# EAGLE schematic Nusbio - Ex Bread Board (EAGLE 7.6.0)
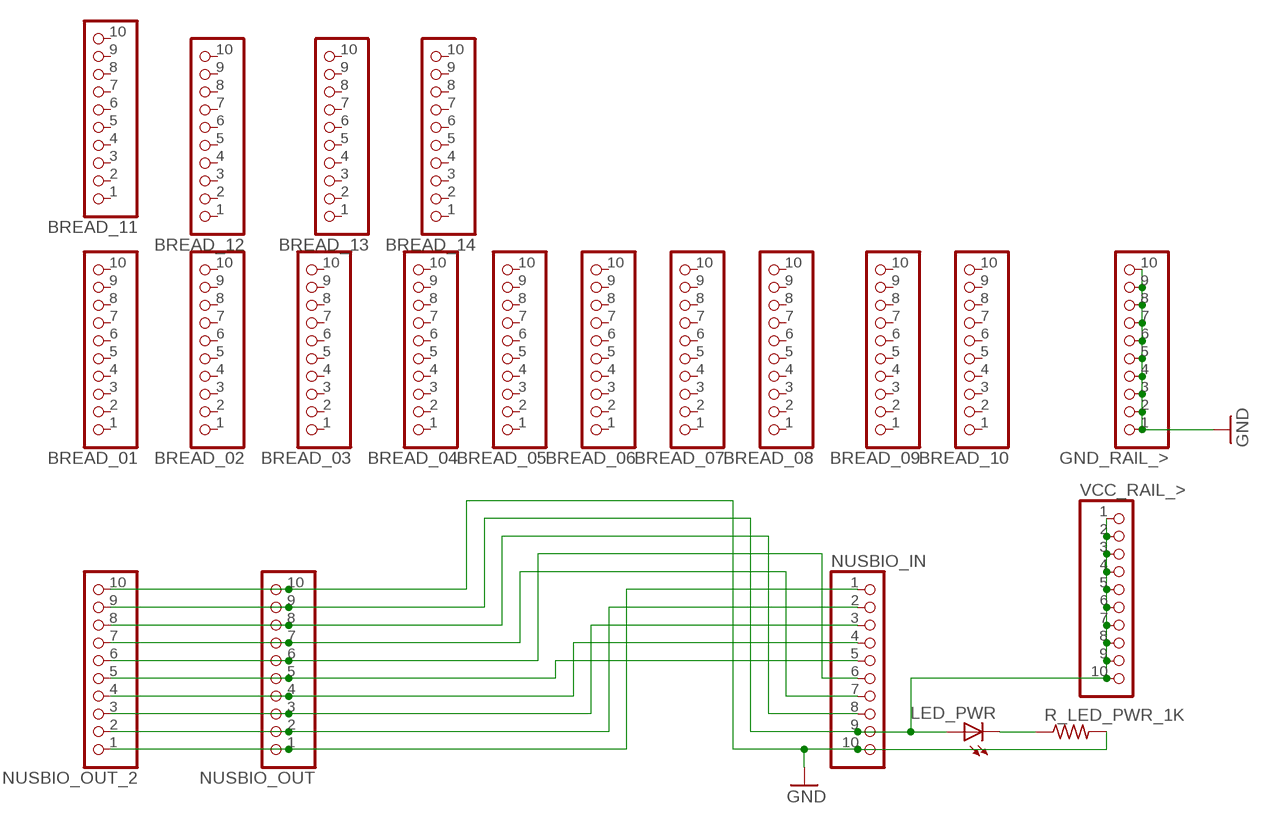
[diagram p0: schematic, sheet 1]

## Parts
BREAD_01  PINHD-1X10  [1X10-BIG]
BREAD_02  PINHD-1X10  [1X10-BIG]
BREAD_03  PINHD-1X10  [1X10-BIG]
BREAD_04  PINHD-1X10  [1X10-BIG]
BREAD_05  PINHD-1X10  [1X10-BIG]
BREAD_06  PINHD-1X10  [1X10-BIG]
BREAD_07  PINHD-1X10  [1X10-BIG]
BREAD_08  PINHD-1X10  [1X10-BIG]
BREAD_09  PINHD-1X10  [1X10-BIG]
BREAD_10  PINHD-1X10  [1X10-BIG]
BREAD_11  PINHD-1X10  [1X10-BIG]
BREAD_12  PINHD-1X10  [1X10-BIG]
BREAD_13  PINHD-1X10  [1X10-BIG]
BREAD_14  PINHD-1X10  [1X10-BIG]
GND_RAIL_>  PINHD-1X10  [1X10-BIG]
LED_PWR  LEDSMT1206  [1206]
NUSBIO_IN  PINHD-1X10  [1X10-BIG]
NUSBIO_OUT  PINHD-1X10  [1X10-BIG]
NUSBIO_OUT_2  PINHD-1X10  [1X10-BIG]
R_LED_PWR_1K  R-US_R1206  [R1206]
VCC_RAIL_>  PINHD-1X10  [1X10-BIG]

## Nets
GND: GND_RAIL_>.1 GND_RAIL_>.2 GND_RAIL_>.3 GND_RAIL_>.4 GND_RAIL_>.5 GND_RAIL_>.6 GND_RAIL_>.7 GND_RAIL_>.8 GND_RAIL_>.9 GND_RAIL_>.10 NUSBIO_IN.10 NUSBIO_OUT.10 NUSBIO_OUT_2.10 R_LED_PWR_1K.2
N$1: NUSBIO_IN.1 NUSBIO_OUT.1 NUSBIO_OUT_2.1
N$2: NUSBIO_IN.2 NUSBIO_OUT.2 NUSBIO_OUT_2.2
N$3: NUSBIO_IN.3 NUSBIO_OUT.3 NUSBIO_OUT_2.3
N$4: NUSBIO_IN.4 NUSBIO_OUT.4 NUSBIO_OUT_2.4
N$5: NUSBIO_IN.5 NUSBIO_OUT.5 NUSBIO_OUT_2.5
N$6: NUSBIO_IN.6 NUSBIO_OUT.6 NUSBIO_OUT_2.6
N$7: NUSBIO_IN.7 NUSBIO_OUT.7 NUSBIO_OUT_2.7
N$8: NUSBIO_IN.8 NUSBIO_OUT.8 NUSBIO_OUT_2.8
N$9: LED_PWR.A NUSBIO_IN.9 NUSBIO_OUT.9 NUSBIO_OUT_2.9 VCC_RAIL_>.1 VCC_RAIL_>.2 VCC_RAIL_>.3 VCC_RAIL_>.4 VCC_RAIL_>.5 VCC_RAIL_>.6 VCC_RAIL_>.7 VCC_RAIL_>.8 VCC_RAIL_>.9 VCC_RAIL_>.10
N$11: LED_PWR.C R_LED_PWR_1K.1
Unconnected: BREAD_01.1 BREAD_01.2 BREAD_01.3 BREAD_01.4 BREAD_01.5 BREAD_01.6 BREAD_01.7 BREAD_01.8 BREAD_01.9 BREAD_01.10 BREAD_02.1 BREAD_02.2 BREAD_02.3 BREAD_02.4 BREAD_02.5 BREAD_02.6 BREAD_02.7 BREAD_02.8 BREAD_02.9 BREAD_02.10 BREAD_03.1 BREAD_03.2 BREAD_03.3 BREAD_03.4 BREAD_03.5 BREAD_03.6 BREAD_03.7 BREAD_03.8 BREAD_03.9 BREAD_03.10 BREAD_04.1 BREAD_04.2 BREAD_04.3 BREAD_04.4 BREAD_04.5 BREAD_04.6 BREAD_04.7 BREAD_04.8 BREAD_04.9 BREAD_04.10 BREAD_05.1 BREAD_05.2 BREAD_05.3 BREAD_05.4 BREAD_05.5 BREAD_05.6 BREAD_05.7 BREAD_05.8 BREAD_05.9 BREAD_05.10 BREAD_06.1 BREAD_06.2 BREAD_06.3 BREAD_06.4 BREAD_06.5 BREAD_06.6 BREAD_06.7 BREAD_06.8 BREAD_06.9 BREAD_06.10 BREAD_07.1 BREAD_07.2 BREAD_07.3 BREAD_07.4 BREAD_07.5 BREAD_07.6 BREAD_07.7 BREAD_07.8 BREAD_07.9 BREAD_07.10 BREAD_08.1 BREAD_08.2 BREAD_08.3 BREAD_08.4 BREAD_08.5 BREAD_08.6 BREAD_08.7 BREAD_08.8 BREAD_08.9 BREAD_08.10 BREAD_09.1 BREAD_09.2 BREAD_09.3 BREAD_09.4 BREAD_09.5 BREAD_09.6 BREAD_09.7 BREAD_09.8 BREAD_09.9 BREAD_09.10 BREAD_10.1 BREAD_10.2 BREAD_10.3 BREAD_10.4 BREAD_10.5 BREAD_10.6 BREAD_10.7 BREAD_10.8 BREAD_10.9 BREAD_10.10 BREAD_11.1 BREAD_11.2 BREAD_11.3 BREAD_11.4 BREAD_11.5 BREAD_11.6 BREAD_11.7 BREAD_11.8 BREAD_11.9 BREAD_11.10 BREAD_12.1 BREAD_12.2 BREAD_12.3 BREAD_12.4 BREAD_12.5 BREAD_12.6 BREAD_12.7 BREAD_12.8 BREAD_12.9 BREAD_12.10 BREAD_13.1 BREAD_13.2 BREAD_13.3 BREAD_13.4 BREAD_13.5 BREAD_13.6 BREAD_13.7 BREAD_13.8 BREAD_13.9 BREAD_13.10 BREAD_14.1 BREAD_14.2 BREAD_14.3 BREAD_14.4 BREAD_14.5 BREAD_14.6 BREAD_14.7 BREAD_14.8 BREAD_14.9 BREAD_14.10

## Library data of the parts
BREAD_01-BREAD_09 BREAD_10-BREAD_14 GND_RAIL_> NUSBIO_IN NUSBIO_OUT NUSBIO_OUT_2 VCC_RAIL_> = adafruit:PINHD-1X10: Pin header 1x10 0.1" spacing With round pins
LED_PWR = adafruit:LED: LED OSRAM: - CHIPLED LG R971, LG N971, LY N971, LG Q971, LY Q971, LO R971, LY R971 LH N974, LH R974 LS Q976, LO Q976, LY Q976 LO Q996 - Hyper CHIPLED LW Q18S LB Q993, LB Q99A, LB R99A - SideLED LS A670, LO A670, LY A670, LG A670, LP A670 LB A673, LV A673, LT A673, LW A673 LH A674 LY A675 LS A676, LA A676, LO A676, LY A676, LW A676 LS A679, LY A679, LG A679 - Hyper Micro SIDELED® LS Y876, LA Y876, LO Y876, LY Y876 LT Y87S - SmartLED LW L88C, LW L88S LB L89C, LB L89S, LG L890 LS L89K, LO L89K, LY L89K LS L896, LA L896, LO L896, LY L896 - TOPLED LS T670, LO T670, LY T670, LG T670, LP T670 LSG T670, LSP T670, LSY T670, LOP T670, LYG T670 LG T671, LOG T671, LSG T671 LB T673, LV T673, LT T673, LW T673 LH T674 LS T676, LA T676, LO T676, LY T676, LB T676, LH T676, LSB T676, LW T676 LB T67C, LV T67C, LT T67C, LS T67K, LO T67K, LY T67K, LW E67C LS E67B, LA E67B, LO E67B, LY E67B, LB E67C, LV E67C, LT E67C LW T67C LS T679, LY T679, LG T679 LS T770, LO T770, LY T770, LG T770, LP T770 LB T773, LV T773, LT T773, LW T773 LH T774 LS E675, LA E675, LY E675, LS T675 LS T776, LA T776, LO T776, LY T776, LB T776 LHGB T686 LT T68C, LB T68C - Hyper Mini TOPLED® LB M676 - Mini TOPLED Santana® LG M470 LS M47K, LO M47K, LY M47K Source: http://www.osram.convergy.de/
R_LED_PWR_1K = adafruit:R-US_: RESISTOR, American symbol